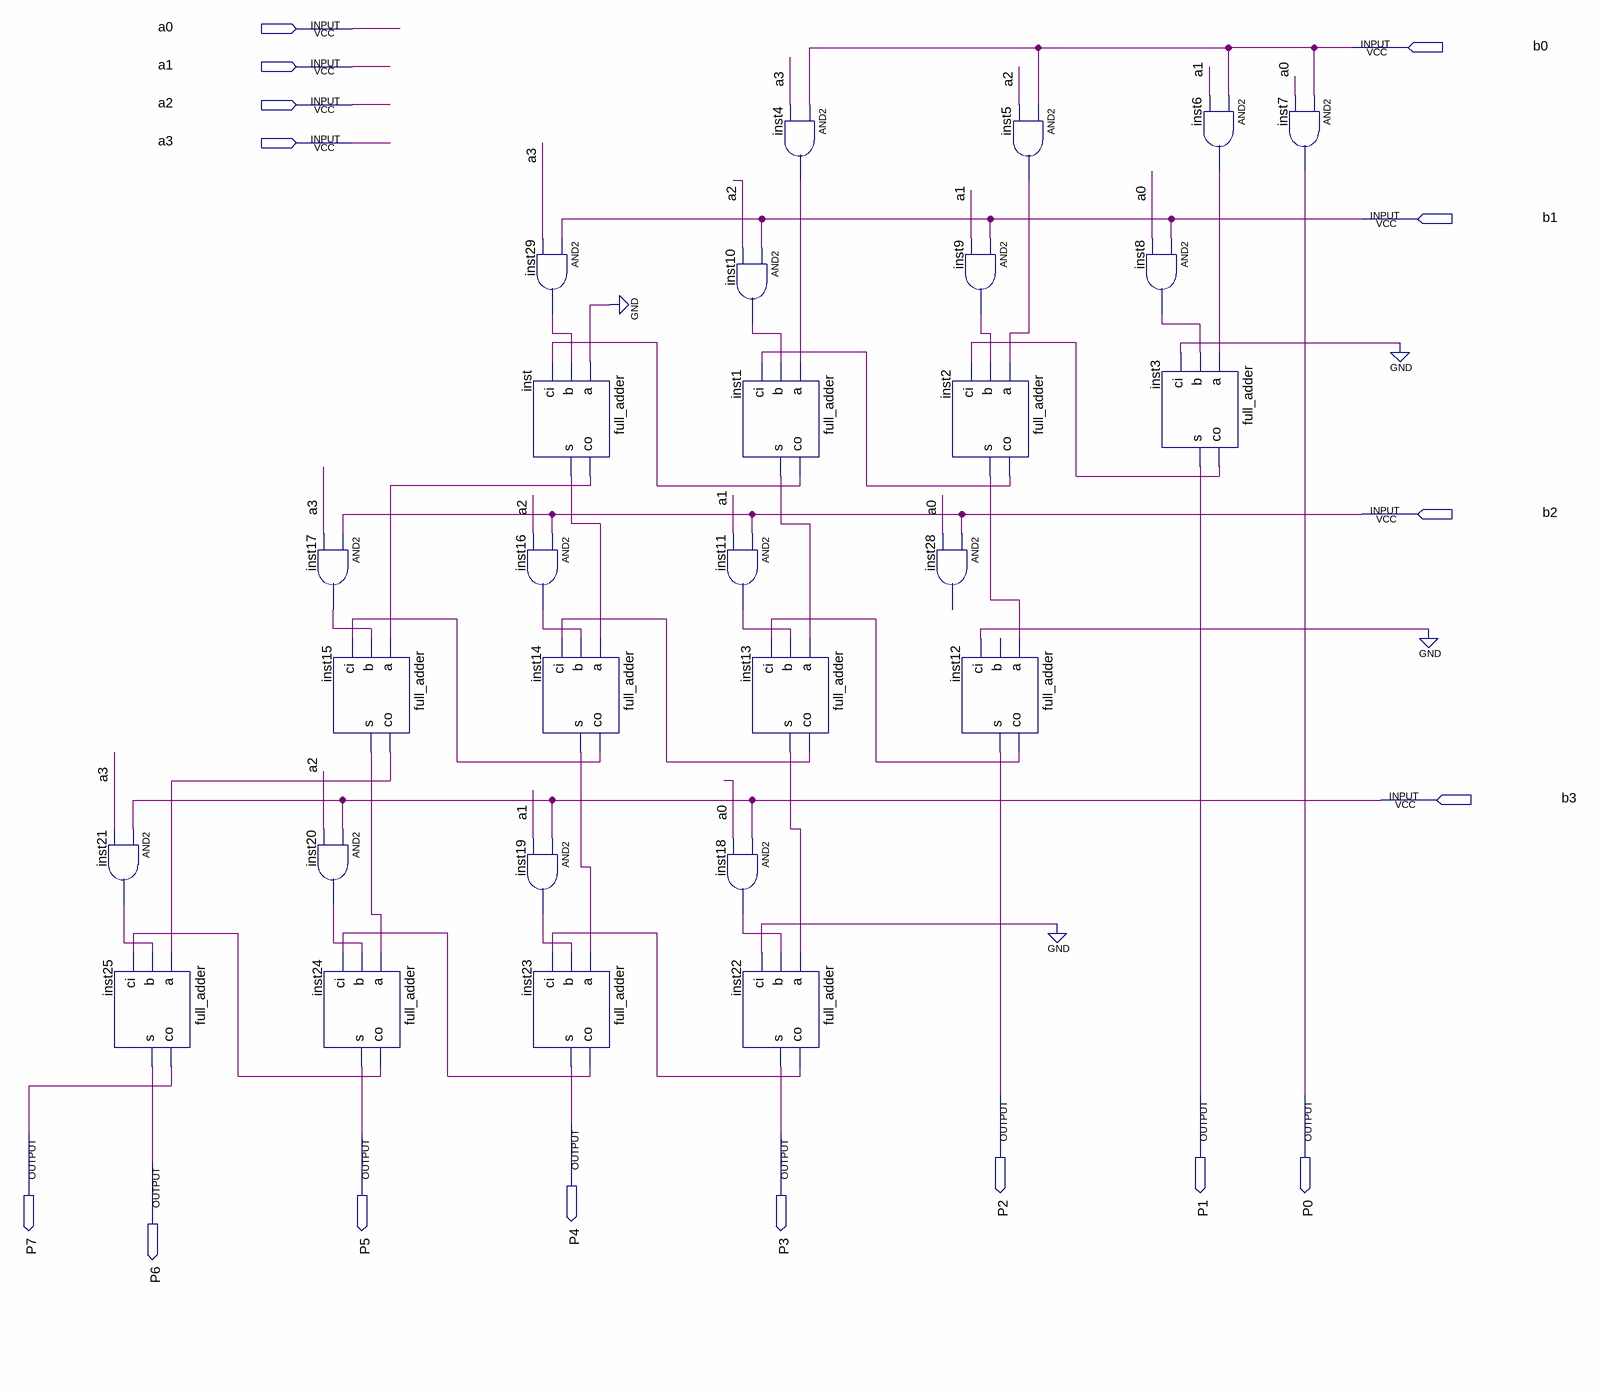
[diagram p0: schematic sheet]
// Quartus schematic AmulB.bdf as structural Verilog: 28 symbols, 16 pins
module AmulB (
  input  a0,
  input  b0,
  input  a1,
  input  a2,
  input  a3,
  input  b1,
  input  b2,
  input  b3,
  output P2,
  output P1,
  output P0,
  output P4,
  output P7,
  output P5,
  output P3,
  output P6
);

  wire inst1_co, inst1_s, inst2_co, inst2_s, inst3_co, inst4_out, inst5_out, inst6_out, inst8_out, inst9_out,
       inst10_out, inst11_out, inst12_co, inst13_co, inst13_s, inst14_co, inst14_s, inst15_co, inst15_s,
       inst16_out, inst17_out, inst18_out, inst19_out, inst20_out, inst21_out, inst22_co, inst23_co,
       inst24_co, inst29_out, inst_co, inst_s;

  and inst21 (inst21_out, b3, a3);
  full_adder inst25 (.a(inst15_co), .b(inst21_out), .ci(inst24_co), .co(P7), .s(P6));
  and inst17 (inst17_out, b2, a3);
  full_adder inst15 (.a(inst_co), .b(inst17_out), .ci(inst14_co), .co(inst15_co), .s(inst15_s));
  and inst20 (inst20_out, b3, a2);
  full_adder inst24 (.a(inst15_s), .b(inst20_out), .ci(inst23_co), .co(inst24_co), .s(P5));
  and inst29 (inst29_out, b1, a3);
  full_adder inst (.a(1'b0), .b(inst29_out), .ci(inst1_co), .co(inst_co), .s(inst_s));
  and inst16 (inst16_out, b2, a2);
  full_adder inst14 (.a(inst_s), .b(inst16_out), .ci(inst13_co), .co(inst14_co), .s(inst14_s));
  and inst19 (inst19_out, b3, a1);
  full_adder inst23 (.a(inst14_s), .b(inst19_out), .ci(inst22_co), .co(inst23_co), .s(P4));
  and inst10 (inst10_out, b1, a2);
  full_adder inst1 (.a(inst4_out), .b(inst10_out), .ci(inst2_co), .co(inst1_co), .s(inst1_s));
  and inst11 (inst11_out, b2, a1);
  full_adder inst13 (.a(inst1_s), .b(inst11_out), .ci(inst12_co), .co(inst13_co), .s(inst13_s));
  and inst18 (inst18_out, b3, a0);
  full_adder inst22 (.a(inst13_s), .b(inst18_out), .ci(1'b0), .co(inst22_co), .s(P3));
  and inst4 (inst4_out, b0, a3);
  and inst9 (inst9_out, b1, a1);
  full_adder inst2 (.a(inst5_out), .b(inst9_out), .ci(inst3_co), .co(inst2_co), .s(inst2_s));
  // AND2 inst28 has open pins: IN1=b2, IN2=a0, OUT=open
  full_adder inst12 (.a(inst2_s), .ci(1'b0), .co(inst12_co), .s(P2));  // open: b
  and inst5 (inst5_out, b0, a2);
  and inst8 (inst8_out, b1, a0);
  and inst6 (inst6_out, b0, a1);
  full_adder inst3 (.a(inst6_out), .b(inst8_out), .ci(1'b0), .co(inst3_co), .s(P1));
  and inst7 (P0, b0, a0);
endmodule
